# EAGLE design programming adaptor - internal (EAGLE 9.4.0)
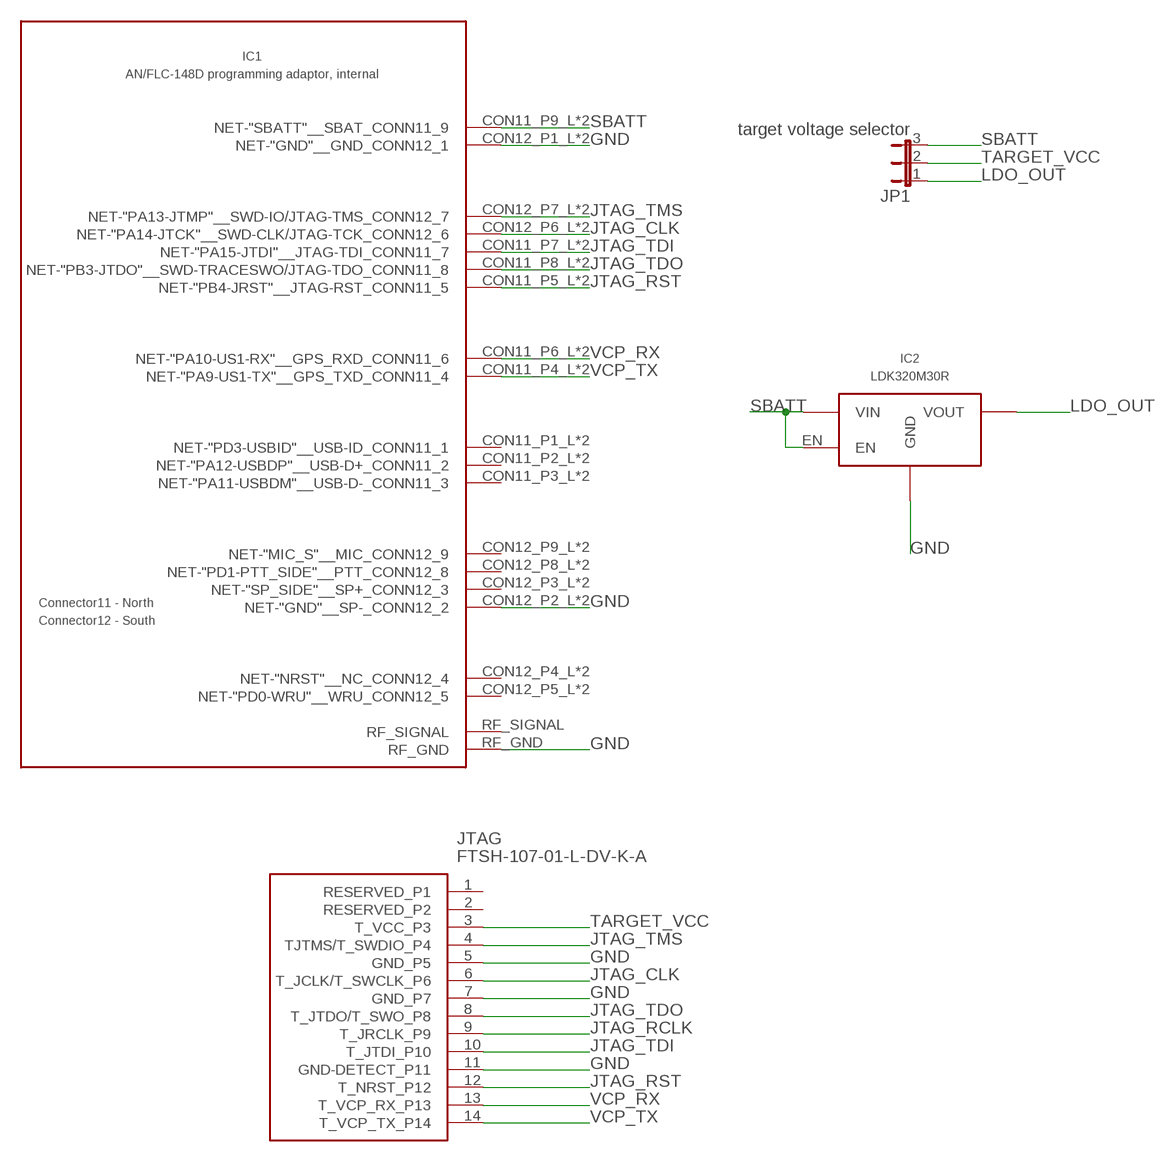
[diagram p0: schematic, sheet 1]

## Parts
IC1  AN/FLC-148D programming adaptor, internal  FLC-148INTERNAL_CONNECTOR  [INTERNAL_CONNECTOR]
IC2  LDK320M30R  LDK320SOT-23-5L  [SOT-23-5L]
JP1  target voltage selector  JP2E  [JP2]
JTAG  FTSH-107-01-L-DV-K-A  [FTSH10701LDVKA]

## Nets
GND: IC1.CON12_P1_L(NET-"GND"__GND_CONN12_1) IC1.CON12_P1_R(NET-"GND"__GND_CONN12_1) IC1.CON12_P2_L(NET-"GND"__SP-_CONN12_2) IC1.CON12_P2_R(NET-"GND"__SP-_CONN12_2) IC1.RF_GND IC2.GND JTAG.5(GND_P5) JTAG.7(GND_P7) JTAG.11(GND-DETECT_P11)
JTAG_CLK [Signal]: IC1.CON12_P6_L(NET-"PA14-JTCK"__SWD-CLK/JTAG-TCK_CONN12_6) IC1.CON12_P6_R(NET-"PA14-JTCK"__SWD-CLK/JTAG-TCK_CONN12_6) JTAG.6(T_JCLK/T_SWCLK_P6)
JTAG_RCLK: JTAG.9(T_JRCLK_P9)
JTAG_RST [Signal]: IC1.CON11_P5_L(NET-"PB4-JRST"__JTAG-RST_CONN11_5) IC1.CON11_P5_R(NET-"PB4-JRST"__JTAG-RST_CONN11_5) JTAG.12(T_NRST_P12)
JTAG_TDI [Signal]: IC1.CON11_P7_L(NET-"PA15-JTDI"__JTAG-TDI_CONN11_7) IC1.CON11_P7_R(NET-"PA15-JTDI"__JTAG-TDI_CONN11_7) JTAG.10(T_JTDI_P10)
JTAG_TDO [Signal]: IC1.CON11_P8_L(NET-"PB3-JTDO"__SWD-TRACESWO/JTAG-TDO_CONN11_8) IC1.CON11_P8_R(NET-"PB3-JTDO"__SWD-TRACESWO/JTAG-TDO_CONN11_8) JTAG.8(T_JTDO/T_SWO_P8)
JTAG_TMS [Signal]: IC1.CON12_P7_L(NET-"PA13-JTMP"__SWD-IO/JTAG-TMS_CONN12_7) IC1.CON12_P7_R(NET-"PA13-JTMP"__SWD-IO/JTAG-TMS_CONN12_7) JTAG.4(TJTMS/T_SWDIO_P4)
LDO_OUT [Vcc]: IC2.OUT(VOUT) JP1.1
SBATT [Vcc]: IC1.CON11_P9_L(NET-"SBATT"__SBAT_CONN11_9) IC1.CON11_P9_R(NET-"SBATT"__SBAT_CONN11_9) IC2.EN IC2.IN(VIN) JP1.3
TARGET_VCC: JP1.2 JTAG.3(T_VCC_P3)
VCP_RX [Signal]: IC1.CON11_P6_L(NET-"PA10-US1-RX"__GPS_RXD_CONN11_6) IC1.CON11_P6_R(NET-"PA10-US1-RX"__GPS_RXD_CONN11_6) JTAG.13(T_VCP_RX_P13)
VCP_TX [Signal]: IC1.CON11_P4_L(NET-"PA9-US1-TX"__GPS_TXD_CONN11_4) IC1.CON11_P4_R(NET-"PA9-US1-TX"__GPS_TXD_CONN11_4) JTAG.14(T_VCP_TX_P14)
Unconnected: IC1.CON11_P1_L(NET-"PD3-USBID"__USB-ID_CONN11_1) IC1.CON11_P1_R(NET-"PD3-USBID"__USB-ID_CONN11_1) IC1.CON11_P2_L(NET-"PA12-USBDP"__USB-D+_CONN11_2) IC1.CON11_P2_R(NET-"PA12-USBDP"__USB-D+_CONN11_2) IC1.CON11_P3_L(NET-"PA11-USBDM"__USB-D-_CONN11_3) IC1.CON11_P3_R(NET-"PA11-USBDM"__USB-D-_CONN11_3) IC1.CON12_P3_L(NET-"SP_SIDE"__SP+_CONN12_3) IC1.CON12_P3_R(NET-"SP_SIDE"__SP+_CONN12_3) IC1.CON12_P4_L(NET-"NRST"__NC_CONN12_4) IC1.CON12_P4_R(NET-"NRST"__NC_CONN12_4) IC1.CON12_P5_L(NET-"PD0-WRU"__WRU_CONN12_5) IC1.CON12_P5_R(NET-"PD0-WRU"__WRU_CONN12_5) IC1.CON12_P8_L(NET-"PD1-PTT_SIDE"__PTT_CONN12_8) IC1.CON12_P8_R(NET-"PD1-PTT_SIDE"__PTT_CONN12_8) IC1.CON12_P9_L(NET-"MIC_S"__MIC_CONN12_9) IC1.CON12_P9_R(NET-"MIC_S"__MIC_CONN12_9) IC1.RF_SIGNAL JTAG.1(RESERVED_P1) JTAG.2(RESERVED_P2)

## Library data of the parts
IC1 = programming adaptor:FLC-148
IC2 = LDK320 5V LDO:LDK320
JP1 = jumper:JP2E: JUMPER
JTAG = STM32 JTAG 1.27mm 14pin header:FTSH-107-01-L-DV-K-A: Headers & Wire Housings .050" Micro Terminal Strip Source: Datasheet <https://componentsearchengine.com/Datasheets/1/FTSH-107-01-L-DV-K-A.pdf>; DESCRIPTION: Headers & Wire Housings .050" Micro Terminal Strip; HEIGHT: 5.97mm; MANUFACTURER_NAME: SAMTEC; MANUFACTURER_PART_NUMBER: FTSH-107-01-L-DV-K-A; MOUSER_PART_NUMBER: 200-FTSH10701LDVKA; MOUSER_PRICE-STOCK: https://www.mouser.com/Search/Refine.aspx?Keyword=200-FTSH10701LDVKA

## Net classes
0 GND: width 0.3 mm, drill 0.3 mm, clearance 0.3 mm
1 Vcc: width 0.3 mm, drill 0.3 mm, clearance 0.3 mm
2 Signal: width 0.3 mm, drill 0.3 mm, clearance 0.3 mm

## Board
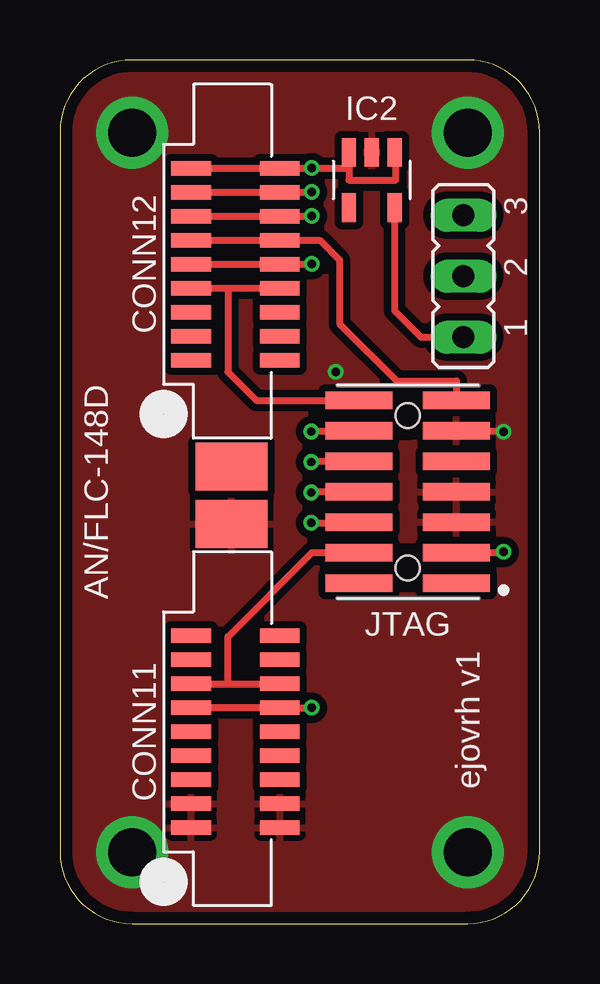
[diagram p1: board, top side]
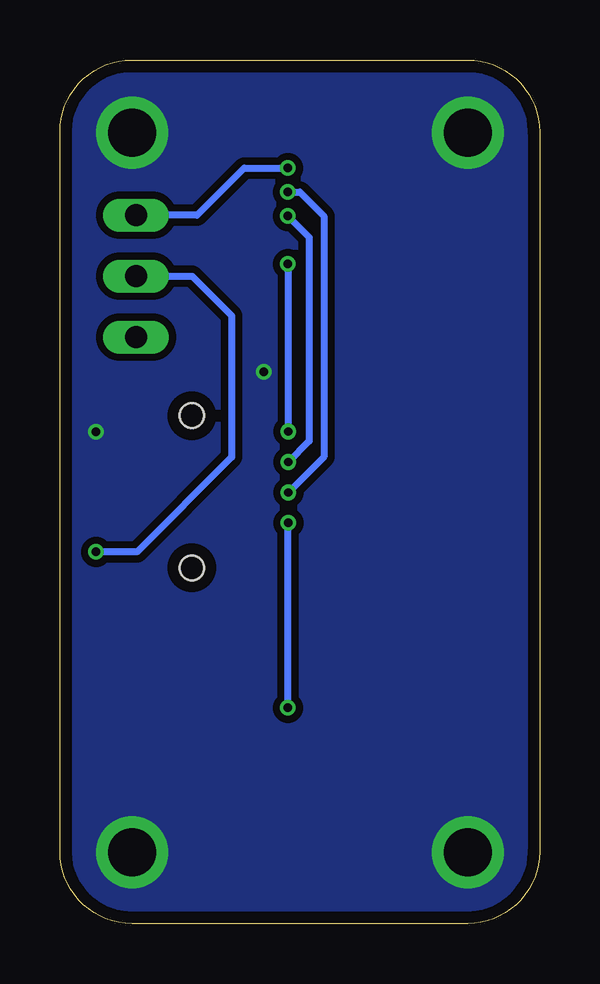
[diagram p2: board, bottom side, seen from below]

Size 20 x 36 mm. Coordinates in mm from the lower left corner, seen from the top.
Outline: 3,0 17,0 arc90 20,3 20,33 arc90 17,36 3,36 arc90 0,33 0,3 arc90 3,0
Copper layers (1*16): Top 0.035mm / dielectric 1.5mm / Bottom 0.035mm
Design rules "markovac_2layer": minimum track width 0.2mm, minimum drill 0.35mm, track to track 0.2mm, track to pad 0.2mm, pad to pad 0.2mm, via to via 0.2mm, smd to smd 0.2mm, copper to edge 0.5mm, drill to drill 8mil, minimum pad ring 0.15mm, minimum via ring 0.15mm, stop-mask expansion 4mil, vias tented up to drill 0.34mm, thermal gap 10mil

### Footprints (pad centres in the part's own frame; a part is rotated, then mirrored left to right if it is on the bottom)
INTERNAL_CONNECTOR = smd 1.65 x 0.6: CON11_P1_L -2.03,5.48; CON11_P1_R 1.67,5.48; CON11_P2_L -2.03,6.48; CON11_P2_R 1.67,6.48; CON11_P3_L -2.03,7.48; CON11_P3_R 1.67,7.48; CON11_P4_L -2.03,8.48; CON11_P4_R 1.67,8.48; CON11_P5_L -2.03,9.48; CON11_P5_R 1.67,9.48; CON11_P6_L -2.03,10.48; CON11_P6_R 1.67,10.48; CON11_P7_L -2.03,11.48; CON11_P7_R 1.67,11.48; CON11_P8_L -2.03,12.48; CON11_P8_R 1.67,12.48; CON11_P9_L -2.03,13.48; CON11_P9_R 1.67,13.48; CON12_P1_L -2.03,-14; CON12_P1_R 1.67,-14; CON12_P2_L -2.03,-13; CON12_P2_R 1.67,-13; CON12_P3_L -2.03,-12; CON12_P3_R 1.67,-12; CON12_P4_L -2.03,-11; CON12_P4_R 1.67,-11; CON12_P5_L -2.03,-10; CON12_P5_R 1.67,-10; CON12_P6_L -2.03,-9; CON12_P6_R 1.67,-9; CON12_P7_L -2.03,-8; CON12_P7_R 1.67,-8; CON12_P8_L -2.03,-7; CON12_P8_R 1.67,-7; CON12_P9_L -2.03,-6; CON12_P9_R 1.67,-6 | smd 3 x 2: RF_GND -0.34,-1.34; RF_SIGNAL -0.35,1.06
SOT-23-5L = smd 0.6 x 1.2: ADJ/NC -0.95,-1.15; EN -0.95,1.15; GND 0,1.15; IN 0.95,1.15; OUT 0.95,-1.15
JP2 = drill 0.914 long: 1 -2.54,0; 2 0,0; 3 2.54,0
FTSH10701LDVKA = smd 0.74 x 2.79: 1 -3.81,-2.035; 2 -3.81,2.035; 3 -2.54,-2.035; 4 -2.54,2.035; 5 -1.27,-2.035; 6 -1.27,2.035; 7 0,-2.035; 8 0,2.035; 9 1.27,-2.035; 10 1.27,2.035; 11 2.54,-2.035; 12 2.54,2.035; 13 3.81,-2.035; 14 3.81,2.035 | hole 1.02: -3.175,0; 3.175,0

### Placement (x,y rotation side)
IC1  7.5,18 0 top
IC2  13,31 0 top
JP1  16.83,26.99 90 top
JTAG  14.5,18 90 top

### Tracks (layer width: path | path; a pad name or v marks a point on that pad's centre or on a via)
GND  (via drill 0.35, 2)
  Top 0.3: JTAG.11 18.46,20.54 v18.5,20.5
  other vias: 11.5,23 17,32.97 3,32.97 3,2.97 17,2.97
  pour Top: -1,36.97 21,36.97 21,-1.03 -1,-1.03
  pour Bottom: -1,36.97 21,36.97 21,-1.44 -1,-1.44
JTAG_CLK  (via drill 0.35)
  Top 0.3: v10.48,16.7 12.44,16.7 JTAG.6 | IC1.CON12_P6_L IC1.CON12_P6_R v10.5,9
  Bottom 0.3: v10.5,9 10.5,16.68 v10.48,16.7
JTAG_RST  (via drill 0.35)
  Top 0.3: JTAG.12 12.44,20.51 v10.48,20.51 | IC1.CON11_P5_L IC1.CON11_P5_R 9.19,27.5 v10.5,27.5
  Bottom 0.3: v10.48,20.51 10.48,27.48 v10.5,27.5
JTAG_TDI  (via drill 0.35)
  Top 0.3: IC1.CON11_P7_L IC1.CON11_P7_R 9.19,29.5 v10.5,29.5 | JTAG.10 10.51,19.27 v10.48,19.24
  Bottom 0.3: v10.5,29.5 9.61,28.61 9.61,20.11 v10.48,19.24
JTAG_TDO  (via drill 0.35)
  Top 0.3: IC1.CON11_P8_L IC1.CON11_P8_R 9.19,30.5 v10.5,30.5 | JTAG.8 10.51,18 v10.48,17.97
  Bottom 0.3: v10.5,30.5 10,30.5 9,29.5 9,19.45 v10.48,17.97
JTAG_TMS
  Top 0.3: JTAG.4 10.51,15.46 7.02,11.98 7,11.95 7,10 | IC1.CON12_P7_L 7,10 | 7,10 IC1.CON12_P7_R
LDO_OUT
  Top 0.3: IC2.OUT 13.95,25.55 15.05,24.45 JP1.1
SBATT  (via drill 0.35)
  Top 0.3: IC1.CON11_P9_L IC1.CON11_P9_R 9.19,31.5 v10.5,31.5 12.05,31.5 | IC2.IN 14,32.2 14,31 12.05,31 12.05,31.5 | IC2.EN 12.05,31.5
  Bottom 0.3: v10.5,31.5 12.31,31.5 14.29,29.53 JP1.3
TARGET_VCC  (via drill 0.35)
  Top 0.3: JTAG.3 18.46,15.46 v18.5,15.5
  Bottom 0.3: JP1.2 14.49,26.99 12.84,25.34 12.84,19.44 16.78,15.5 v18.5,15.5
VCP_RX
  Top 0.3: IC1.CON11_P6_L IC1.CON11_P6_R 10.84,28.48 11.66,27.66 11.66,25 14.04,22.62 16.54,22.62 JTAG.13
VCP_TX
  Top 0.3: 12.4,21.87 JTAG.14 8.19,21.81 7,23 7,26.48 | IC1.CON11_P4_L 7,26.48 | 7,26.48 IC1.CON11_P4_R

### Text on the board
tNames: CONN12 | AN/FLC-148D | CONN11 | ejovrh v1